# EasyEDA Pro project ProProject_运放实验_2024-09-24.epro, schematic Schematic3
Create Date: 2023-09-08; Page Name: P1; Project Name: 运放实验; Schematic Name: Schematic3; Update Date: 2023-09-08; Company: 嘉立创EDA; Page Size: A4; Version: V1.0
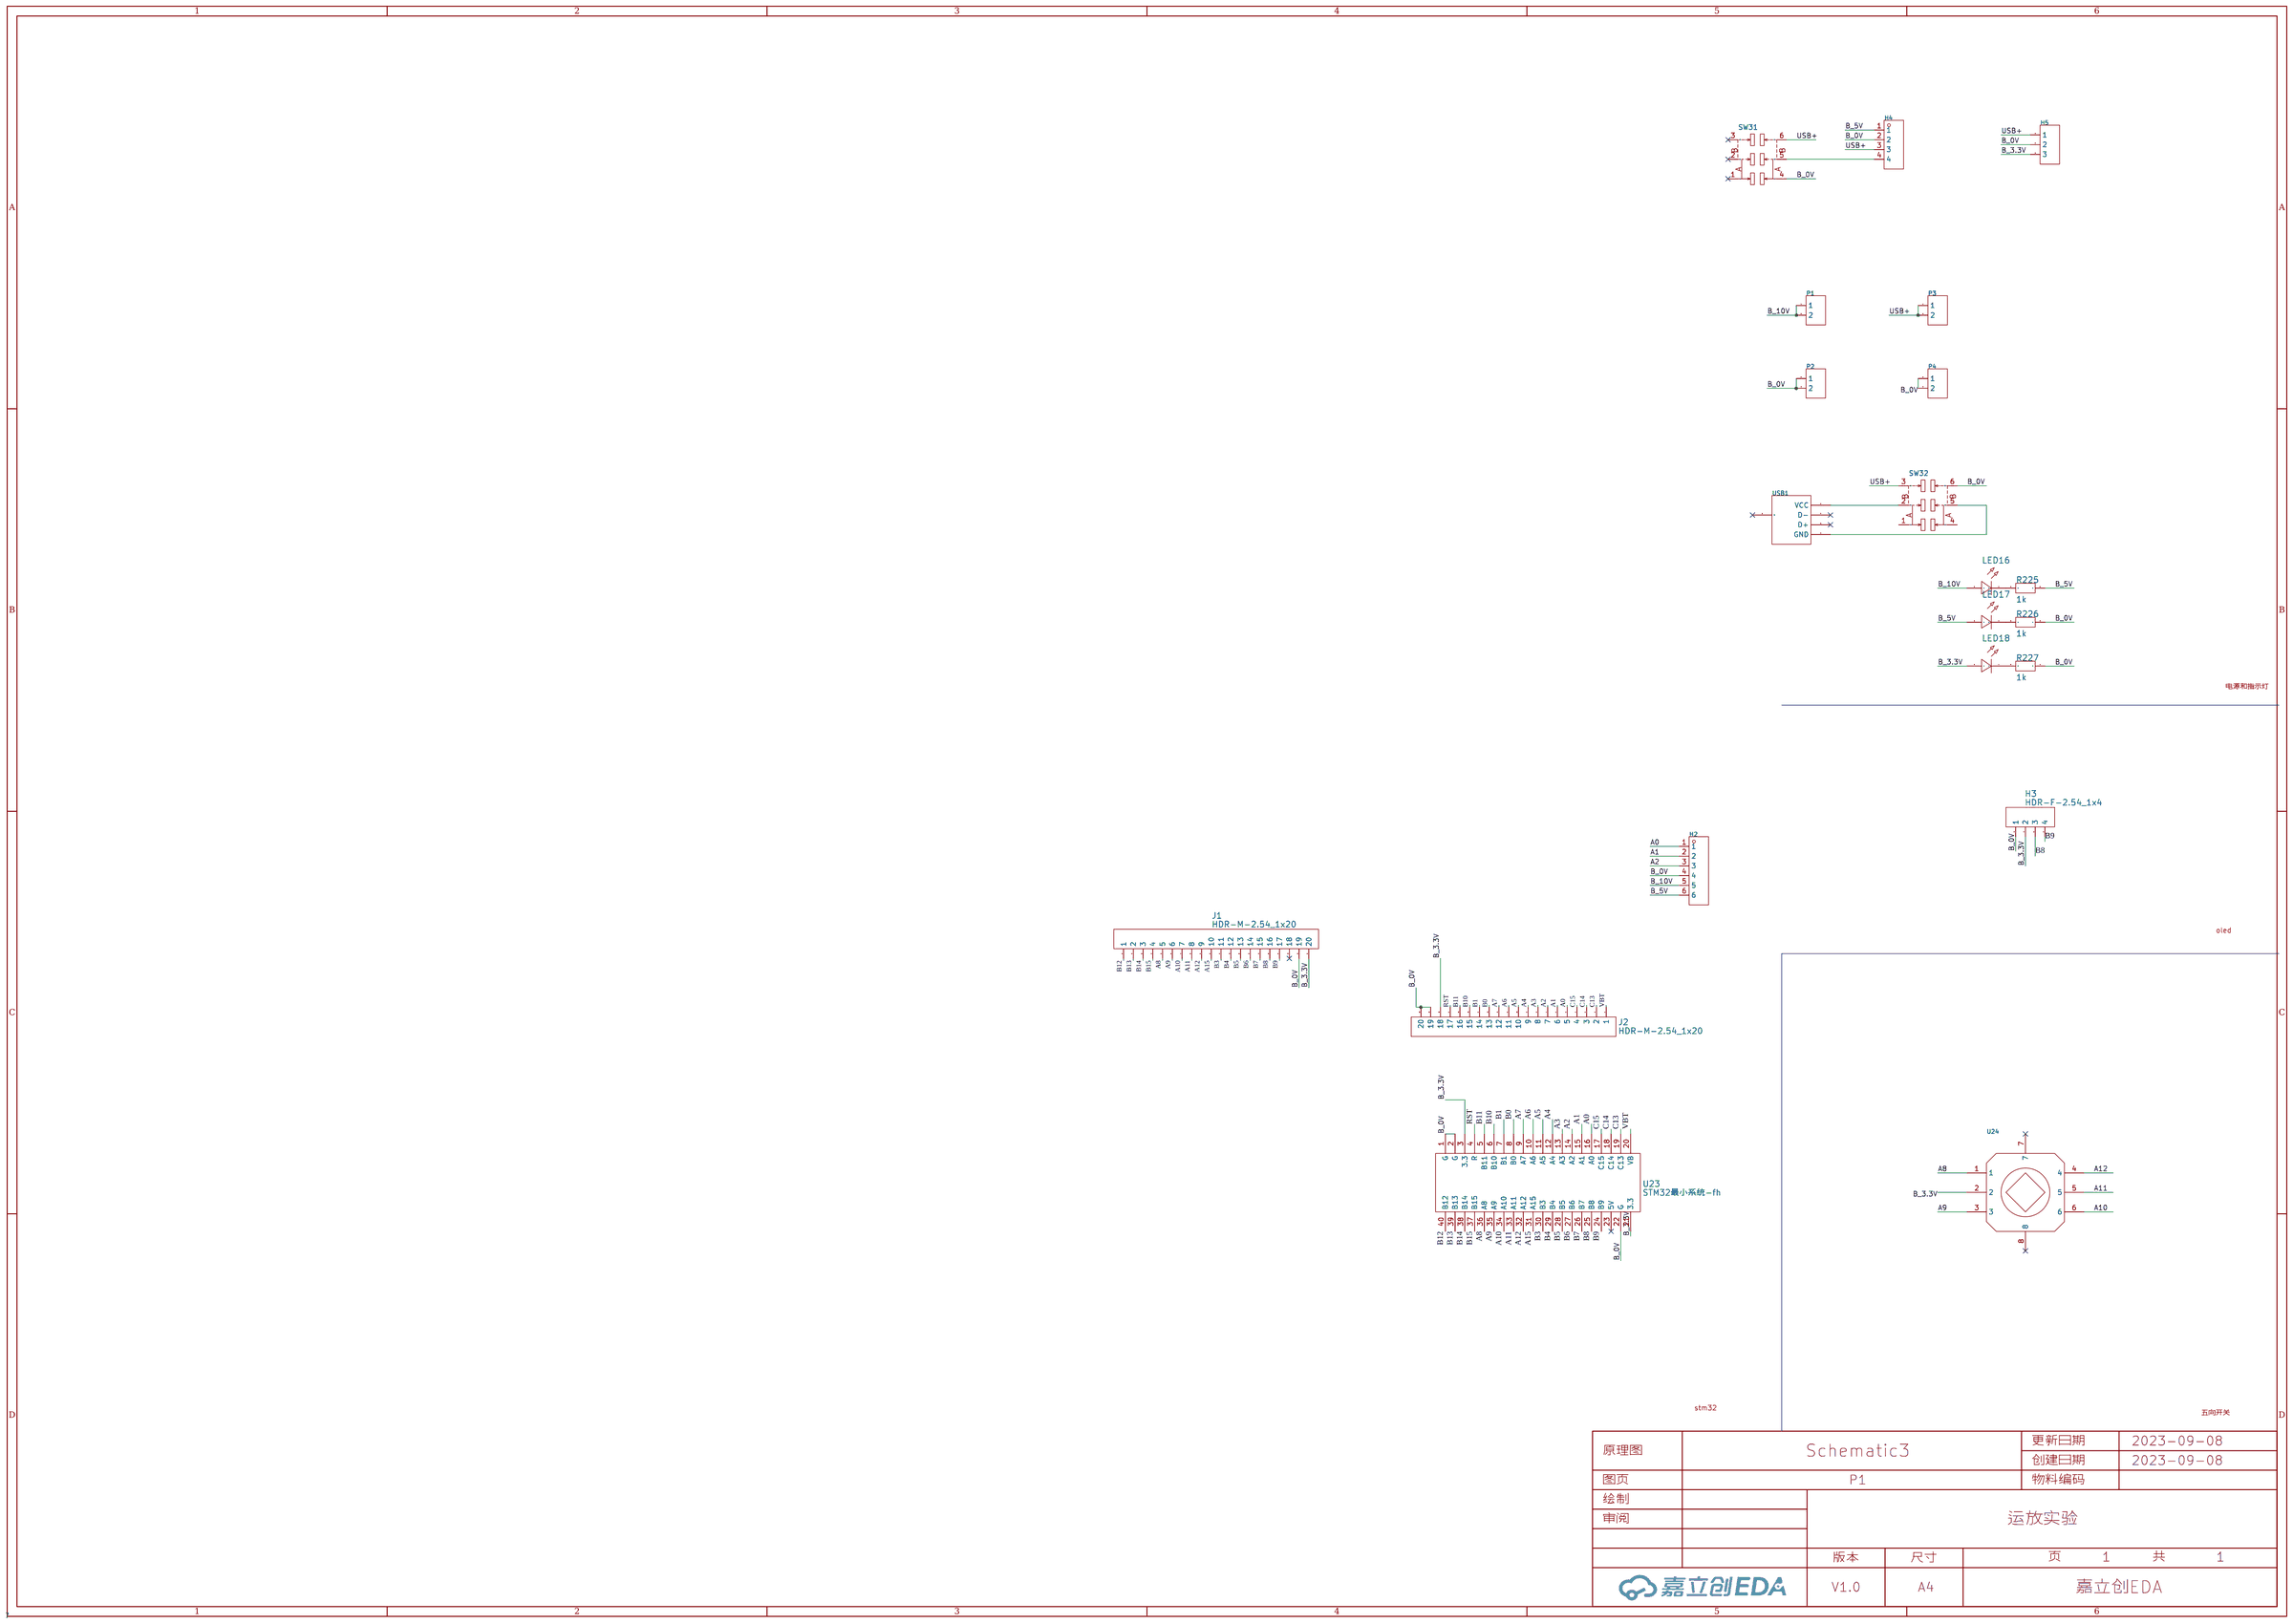
[diagram p0: schematic sheet]

## Parts
H2  PM254V-11-06-H85  [HDR-TH_6P-P2.54-V-F]
H3  HDR-F-2.54_1x4  [HDR-F-2.54_1X4]
H4  2.54-1*4P母  [HDR-TH_4P-P2.54-V-F]
H5  2.54-1*3P针  [HDR-TH_3P-P2.54-V-M-1]
J1  HDR-M-2.54_1x20  [HDR-M-2.54_1X20]
J2  HDR-M-2.54_1x20  [HDR-M-2.54_1X20]
LED16  -  [LED_0805]
LED17  -  [LED_0805]
LED18  -  [LED_0805]
P1  2.54-1*2P母  [HDR-TH_2P-P2.54-V-F]
P2  2.54-1*2P母  [HDR-TH_2P-P2.54-V-F]
P3  2.54-1*2P母  [HDR-TH_2P-P2.54-V-F]
P4  2.54-1*2P母  [HDR-TH_2P-P2.54-V-F]
R225  1k  [R0805]
R226  1k  [R0805]
R227  1k  [R0805]
SW31  MST22D18G2  [SW-SMD_MST22D18G2]
SW32  MST22D18G2  [SW-SMD_MST22D18G2]
U23  STM32最小系统-fh  [STM32最小系统板]
U24  GT-TCA06F-H050-L1  [KEY-SMD_GT-TCA06F-H050-L1]
USB1  AF 90° WJDG  [USB-A-TH_AF-WJDG]

## Library data of the parts
H2 = PM254V-11-06-H85: 排数:单排;总孔位数:6P;间距:2.54mm;插孔结构:1x6P;行距:-;安装类型:直插;圆孔/方孔:方孔;额定电流:3A;额定电压:250V;插孔方向:顶部;塑高:-;工作温度范围:-40℃~+105℃;; LCSC Part Name: 2.54mm 1x6P; Supplier Part: C2832269; Manufacturer: XFCN(兴飞); Supplier Footprint: 插件,P=2.54mm; JLCPCB Part Class: 扩展库; Datasheet: https://atta.szlcsc.com/upload/public/pdf/source/20210514/C2832269_B3EC97736B37C2783BDCE3050AA57447.pdf; Supplier: LCSC; Number of Rows: 单排; Number of Holes: 6P; Pitch: 2.54mm; Holes Structure: 1x6P; Mounting Type: 直插; Circular Hole / Square Hole: 方孔; Current Rating (Max): 3A; Voltage Rating (Max): 250V; Holes Direction: 顶部; Operating Temperature Range: -40℃~+105℃
H3 = HDR-F-2.54_1x4: Supplier Part: C225501; Supplier: LCSC
H4 = 2.54-1*4P母: 排数:单排;总孔位数:4P;间距:2.54mm;插孔结构:1x4P;行距:-;安装类型:直插;圆孔/方孔:方孔;额定电流:3A;额定电压:-;插孔方向:顶部;塑高:-;触头材质:青铜;触头镀层:-;工作温度范围:-40℃~+105℃;焊接温度(最大值):-;; LCSC Part Name: 2.54mm 1x4P; Supplier Part: C2718488; Manufacturer: BOOMELE(博穆精密); Supplier Footprint: 插件,P=2.54mm; JLCPCB Part Class: 扩展库; Datasheet: https://atta.szlcsc.com/upload/public/pdf/source/20210301/C2718488_F4427B881E42CAA8DDB0B1C12B3A522C.pdf; Supplier: LCSC; Number of Rows: 单排; Number of Holes: 4P; Pitch: 2.54mm; Holes Structure: 1x4P; Mounting Type: 直插; Circular Hole / Square Hole: 方孔; Current Rating (Max): 3A; Holes Direction: 顶部; Contact Material: 青铜; Operating Temperature Range: -40℃~+105℃
H5 = 2.54-1*3P针: 排数:单排;总PIN位数:3;间距:2.54mm;插针结构:1x3P;行距:-;安装类型:直插;圆针/方针:方针;额定电流:3A;额定电压:-;配合针长度:-;塑高:-;端接针长度:-;触头材质:-;触头镀层:-;工作温度范围:-40℃~+105℃;颜色:黑色;; LCSC Part Name: 2.54mm 1x3P 直插 方针; Supplier Part: C49257; Manufacturer: BOOMELE(博穆精密); Supplier Footprint: 直插,P=2.54mm; JLCPCB Part Class: 扩展库; Supplier: LCSC; Number of Rows: 单排; Number of Pins: 3; Pitch: 2.54mm; Pin Structure: 1x3P; Mounting Type: 直插; Circluar Pins/Square Pins: 方针; Current Rating (Max): 3A; Operating Temperature Range: -40℃~+105℃; Color: 黑色
J1 J2 = HDR-M-2.54_1x20: Supplier Part: C50981; Supplier: LCSC
LED16-LED18 = LED_0805-R: Supplier Footprint: 0805
P1-P4 = 2.54-1*2P母: 排数:单排;总孔位数:2;间距:2.54mm;插孔结构:1x2P;行距:-;安装类型:直插;塑高:-;触头材质:-;触头镀层:-;; LCSC Part Name: 2.54mm 1x2P; Supplier Part: C49661; Manufacturer: BOOMELE(博穆精密); Supplier Footprint: 直插,P=2.54mm; JLCPCB Part Class: 扩展库; Supplier: LCSC; Number of Rows: 单排; Number of Holes: 2; Pitch: 2.54mm; Holes Structure: 1x2P; Mounting Type: 直插
R225-R227 = 1k
SW31 SW32 = MST22D18G2: 额定电流(DC)：50mA 额定电压(DC)：12V 电路结构：单刀双掷 安装方式：立贴 机械寿命：10000 滑钮形状：矩形柱状 引脚样式：SMD接片 工作温度：-30℃~+80℃ 开关长度：9.1mm 开关宽度：3.6mm 开关高度：3.45mm 柄高：2mm; LCSC Part Name: 两档立式贴片 6脚拨动 柄长2.0MM; Supplier Part: C431544; Manufacturer: SHOU HAN(首韩); Supplier Footprint: SMD,3.6x9.1mm; JLCPCB Part Class: 扩展库; Datasheet: https://atta.szlcsc.com/upload/public/pdf/source/20190925/C431544_D32DFFD935A96A6C5145903882D4ABA1.pdf; Supplier: LCSC
U23 = STM32最小系统-fh
U24 = GT-TCA06F-H050-L1: 机械寿命:-;; LCSC Part Name: 斜五向轻触开关 H5.0mm 400gf 带贴片脚; Supplier Part: C3019725; Manufacturer: G-Switch(品赞); Supplier Footprint: SMD; JLCPCB Part Class: Extended Part; Datasheet: https://atta.szlcsc.com/upload/public/pdf/source/20220627/F7A64F0F346B15FF80DEC5591ADA8118.pdf; Supplier: LCSC; Switch Length: 7.5mm; Switch Width: 7.5mm; Switch Height: 5mm
USB1 = AF 90° WJDG: 连接器类型:Type-A;标准:USB 2.0;公母:母座;触点数量:4;端口数量:1;安装方式:弯插;额定电流 - 电源:1.5A;工作温度范围:-25℃~+85℃;; LCSC Part Name: Type-A 母座 弯插 白胶 卷口有后盖; Supplier Part: C456018; Manufacturer: SHOU HAN(首韩); Supplier Footprint: 插件; JLCPCB Part Class: 扩展库; Supplier: LCSC; Connector Type: Type-A; Standard: USB 2.0; Gender: 母座; Number of Contacts: 4; Number of Ports: 1; Mounting Style: 弯插; Current Rating - Power (Max): 1.5A; Operating Temperature Range: -25℃~+85℃

## Nets
A0: H2.1 J2.5 U23.16(A0)
A1: H2.2 J2.6 U23.15(A1)
A2: H2.3 J2.7 U23.14(A2)
A3: J2.8 U23.13(A3)
A4: J2.9 U23.12(A4)
A5: J2.10 U23.11(A5)
A6: J2.11 U23.10(A6)
A7: J2.12 U23.9(A7)
A8: J1.5 U23.36(A8) U24.1
A9: J1.6 U23.35(A9) U24.3
A10: J1.7 U23.34(A10) U24.6
A11: J1.8 U23.33(A11) U24.5
A12: J1.9 U23.32(A12) U24.4
A15: J1.10 U23.31(A15)
B0: J2.13 U23.8(B0)
B1: J2.14 U23.7(B1)
B3: J1.11 U23.30(B3)
B4: J1.12 U23.29(B4)
B5: J1.13 U23.28(B5)
B6: J1.14 U23.27(B6)
B7: J1.15 U23.26(B7)
B8: H3.3 J1.16 U23.25(B8)
B9: H3.4 J1.17 U23.24(B9)
B10: J2.15 U23.6(B10)
B11: J2.16 U23.5(B11)
B12: J1.1 U23.40(B12)
B13: J1.2 U23.39(B13)
B14: J1.3 U23.38(B14)
B15: J1.4 U23.37(B15)
B_0V: H2.4 H3.1 H4.2 H5.2 J1.19 J2.19 J2.20 P2.1 P2.2 P4.1 P4.2 R226.1 R227.1 SW31.4 SW32.6 U23.1(G) U23.2(G) U23.22(G)
B_3.3V: H3.2 H5.3 J1.20 J2.18 LED18.2(A) U23.3(3.3) U23.21(3.3) U24.2
B_5V: H2.6 H4.1 LED17.2(A) R225.1
B_10V: H2.5 LED16.2(A) P1.1 P1.2
C13: J2.2 U23.19(C13)
C14: J2.3 U23.18(C14)
C15: J2.4 U23.17(C15)
RST: J2.17 U23.4(R)
USB+: H4.3 H5.1 P3.1 P3.2 SW31.6 SW32.3
VBT: J2.1 U23.20(VB)
$1N26687: LED16.1(C) R225.2
$1N26764: LED17.1(C) R226.2
$1N26843: LED18.1(C) R227.2
$1N32503: H4.4 SW31.5
Net-(SW32-2): SW32.2 USB1.1(VCC)
Net-(SW32-5): SW32.5 USB1.4(GND)

Not connected (* = marked no-connect by the designer): J1 18*; SW31 1* 2* 3*; SW32 1 4; U23 23(5V)*; U24 7* 8*; USB1 2(D-)* 3(D+)* 5(SHLD)*

## Notes on the sheet
- 电源和指示灯
- oled
- stm32
- 五向开关
